# EAGLE design mega (EAGLE 9.2.2)
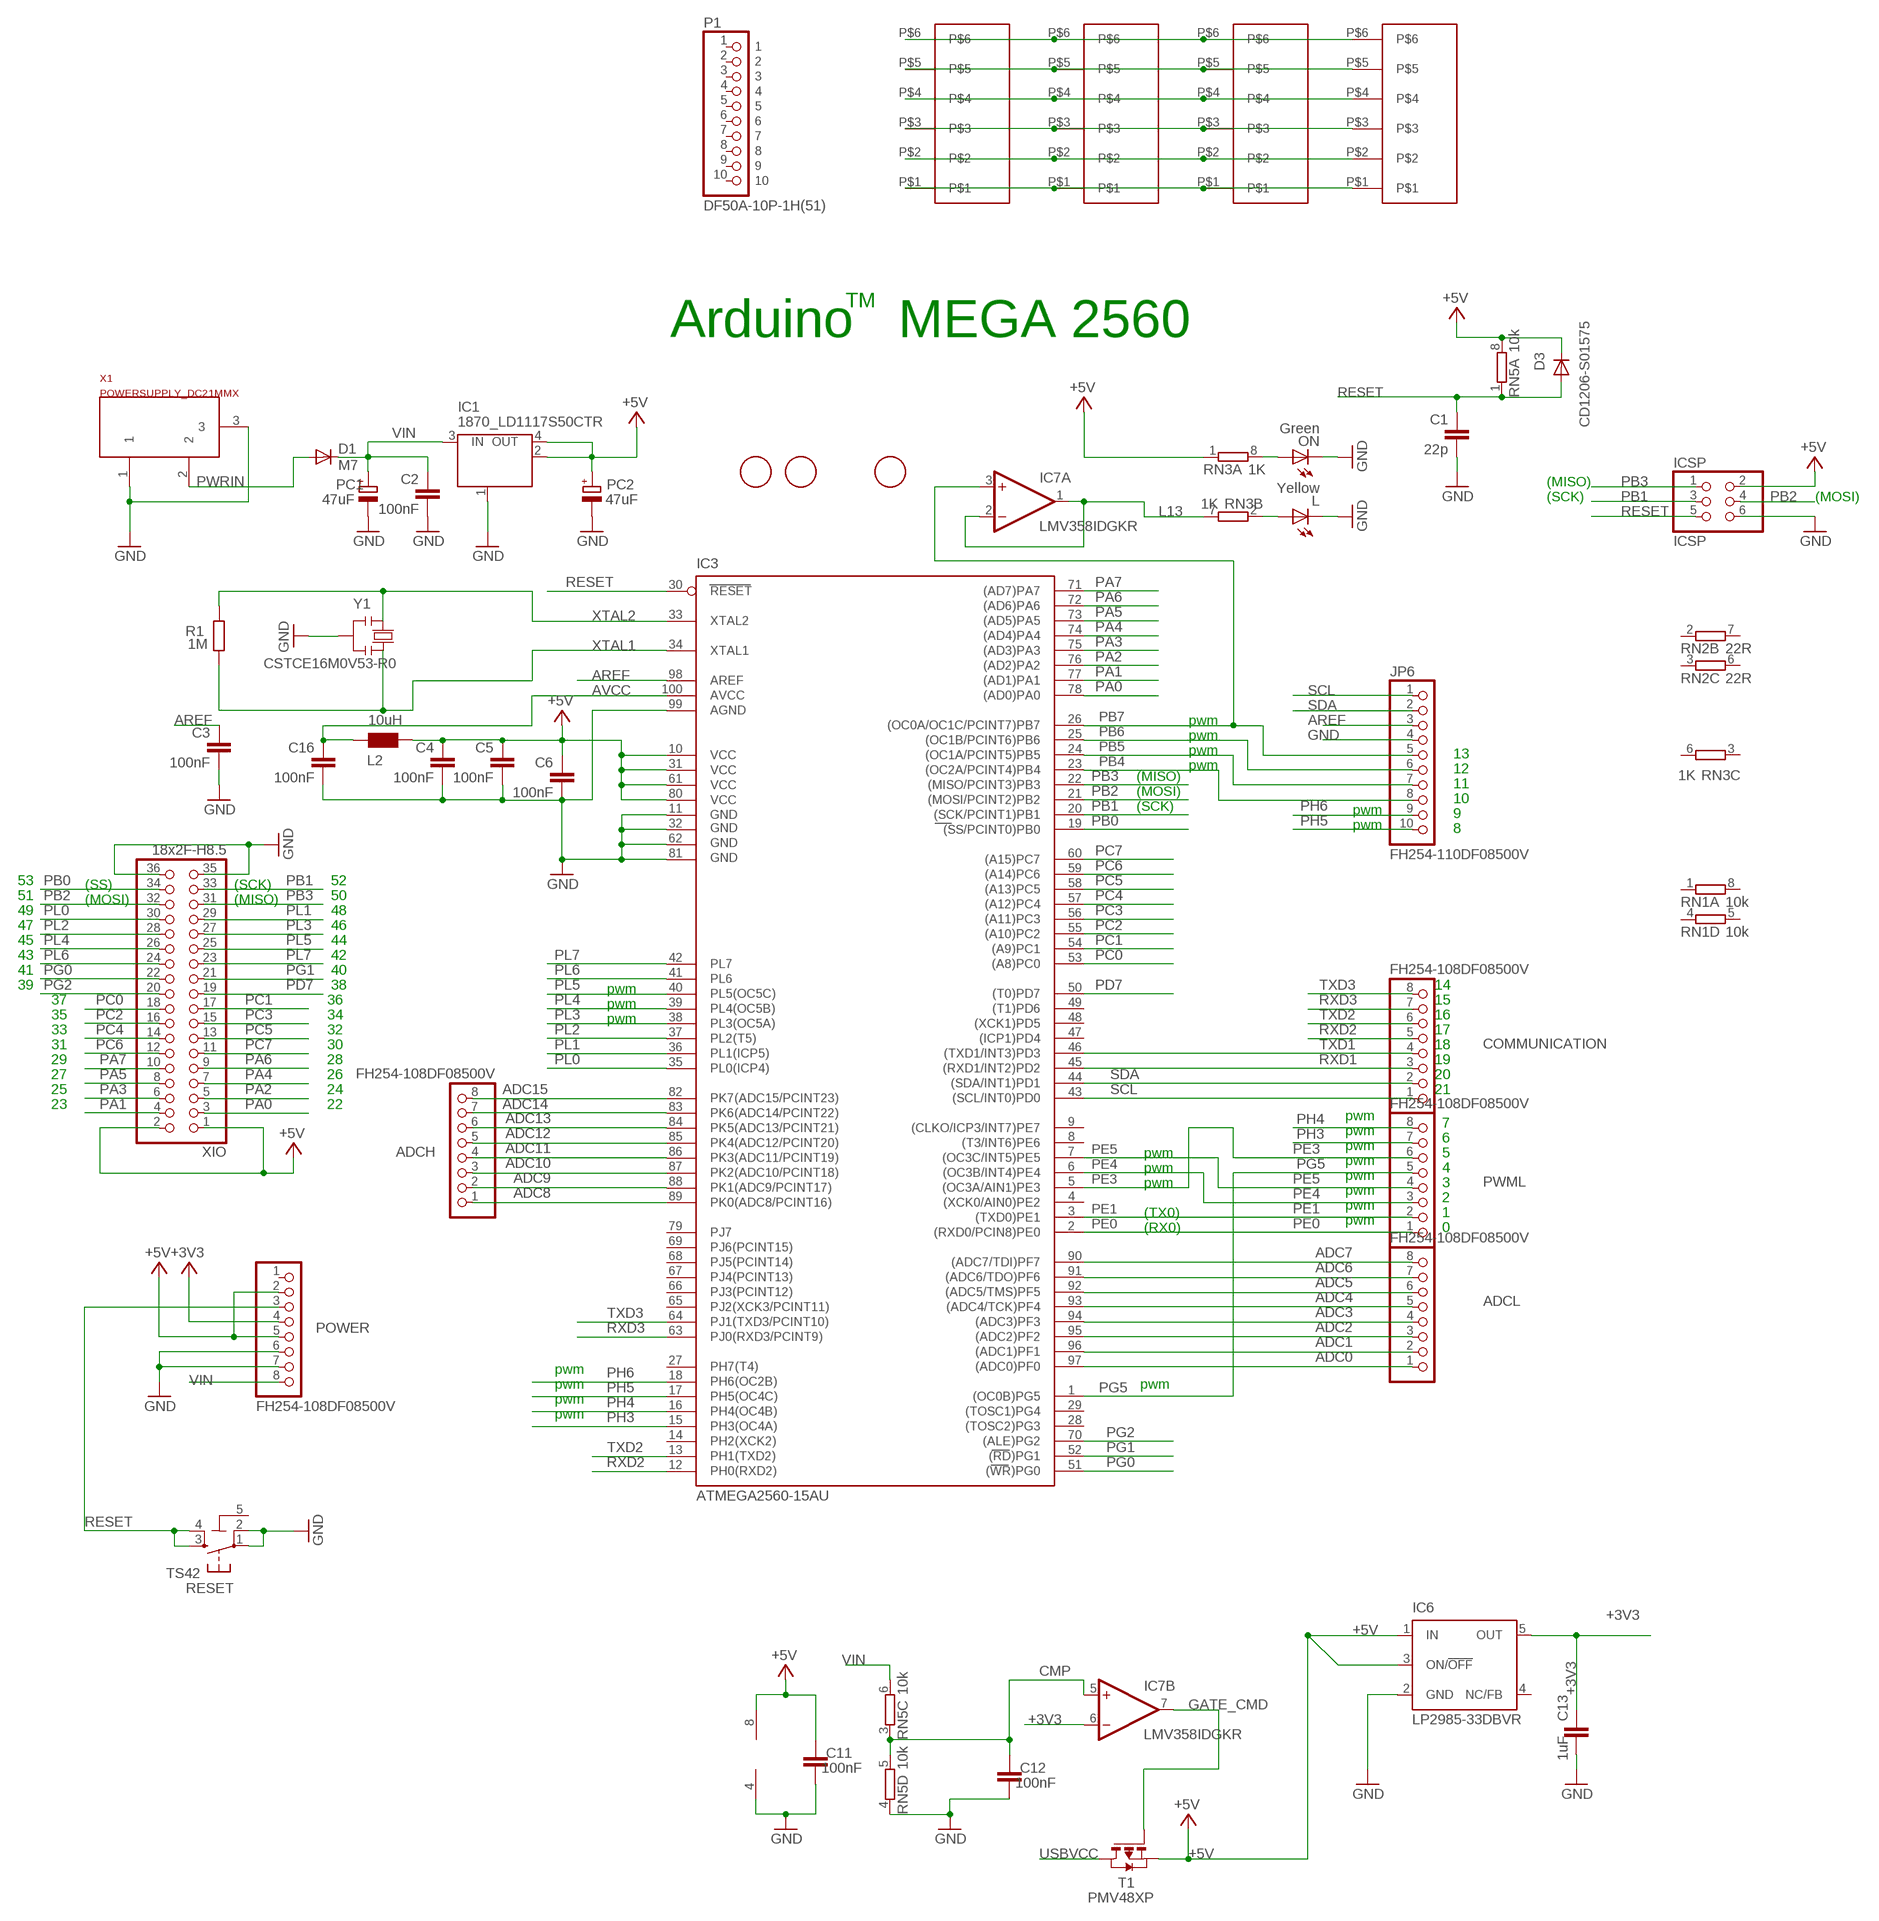
[diagram p0: schematic, sheet 1, part 1 of 2]
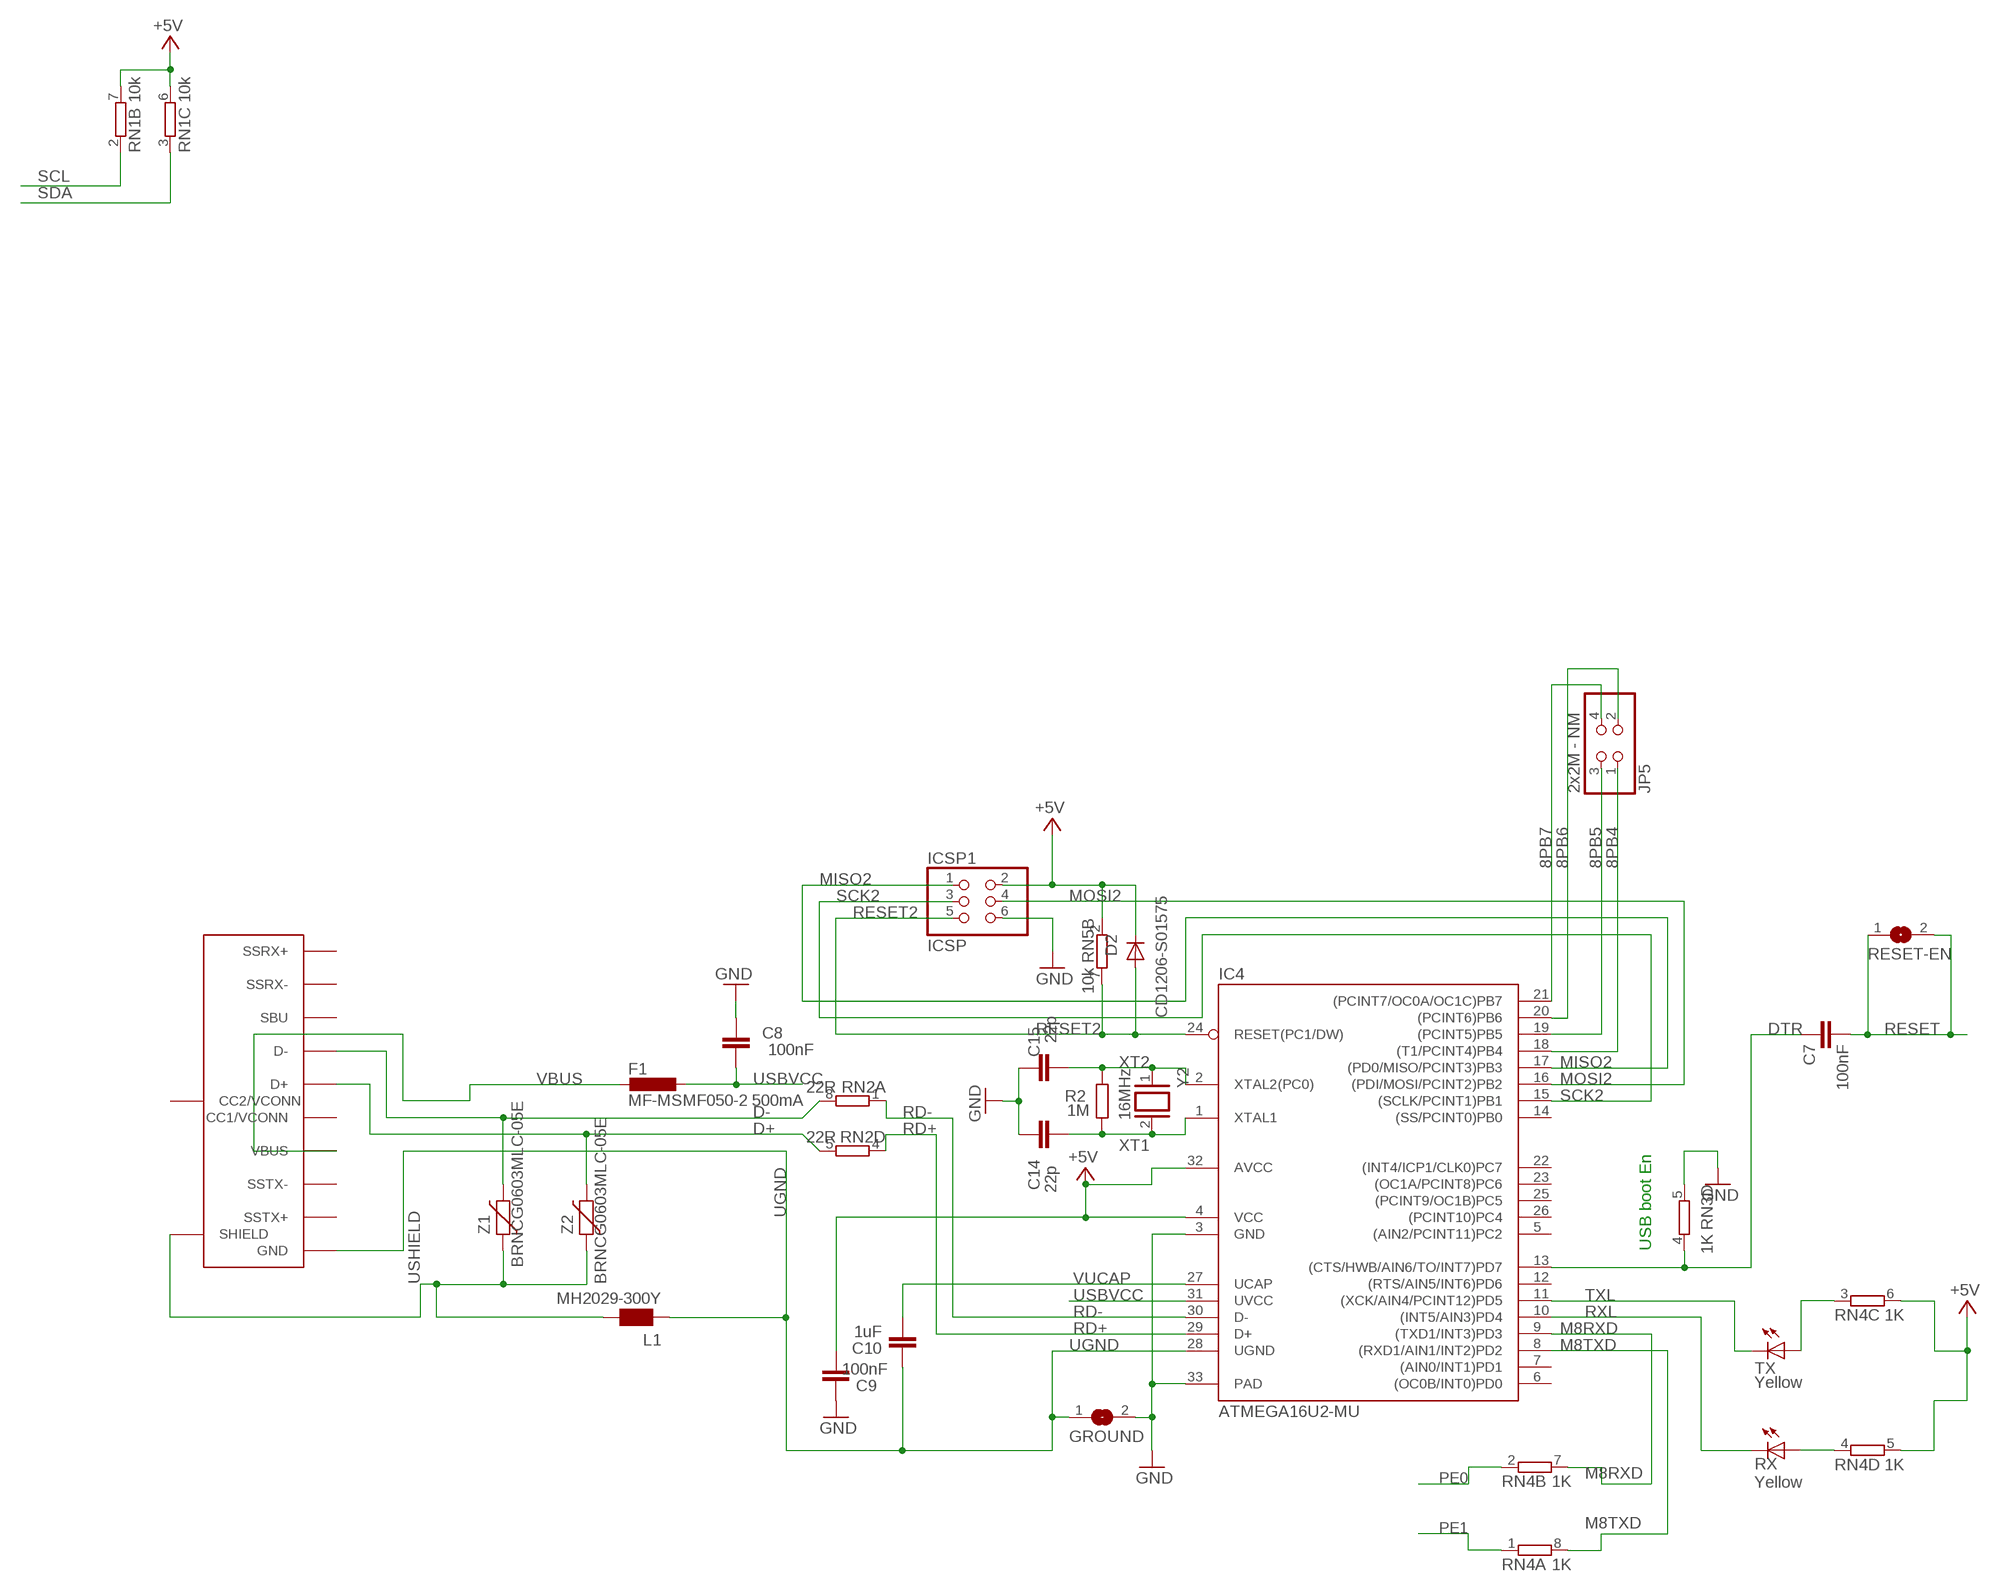
[diagram p1: schematic, sheet 1, part 2 of 2]

## Parts
ADCH  FH254-108DF08500V  0058_FH254-108DF08500V  [1X08]
ADCL  FH254-108DF08500V  0058_FH254-108DF08500V  [1X08]
C1  22p  0014_22PF_0603  [C0603-ROUND]
C2  100nF  0015_100NF_0603  [C0603-ROUND]
C3  100nF  0015_100NF_0603  [C0603-ROUND]
C4  100nF  0015_100NF_0603  [C0603-ROUND]
C5  100nF  0015_100NF_0603  [C0603-ROUND]
C6  100nF  0015_100NF_0603  [C0603-ROUND]
C7  100nF  0015_100NF_0603  [C0603-ROUND]
C8  100nF  0015_100NF_0603  [C0603-ROUND]
C9  100nF  0015_100NF_0603  [C0603-ROUND]
C10  1uF  0006_1UF_0603/GRM188R61E105KA12D  [C0603-ROUND]
C11  100nF  0015_100NF_0603  [C0603-ROUND]
C12  100nF  0015_100NF_0603  [C0603-ROUND]
C13  1uF  0006_1UF_0603/GRM188R61E105KA12D  [C0603-ROUND]
C14  22p  0014_22PF_0603  [C0603-ROUND]
C15  22p  0014_22PF_0603  [C0603-ROUND]
C16  100nF  0015_100NF_0603  [C0603-ROUND]
COMMUNICATION  FH254-108DF08500V  0058_FH254-108DF08500V  [1X08]
D1  M7  0020_M7  [SMB]
D2  CD1206-S01575  0012_CD1206-S01575  [MINIMELF]
D3  CD1206-S01575  0012_CD1206-S01575  [MINIMELF]
F1  MF-MSMF050-2 500mA  0002_MF-MSMF050-2  [L1812]
FD1  FIDUCIALMOUNT  [FIDUCIA-MOUNT]
FD2  FIDUCIALMOUNT  [FIDUCIA-MOUNT]
FD4  FIDUCIALMOUNT  [FIDUCIA-MOUNT]
GROUND  SJ  [SJ]
IC1  1870_LD1117S50CTR  [LINEAR_SOT223]
IC3  ATMEGA2560-15AU  0023_ATMEGA2560-16AU  [TQFP100]
IC4  ATMEGA16U2-MU  0007_ATMEGA16U2-MUR  [MLF32]
IC6  LP2985-33DBVR  0008_TEXLP2985-33DBVR  [SOT23-DBV]
IC7  LMV358IDGKR  0021_LMV358IDGKR  [MSOP08]
ICSP  ICSP  0114_PH254-203DF118A00V  [2X03]
ICSP1  ICSP  0114_PH254-203DF118A00V  [2X03]
JP5  2x2M - NM  PINHD-2X2  [2X02]
JP6  FH254-110DF08500V  1216_FH254-110DF08500T30  [1X10]
L  Yellow  0044_KPT-2012YC  [CHIPLED_0805]
L1  MH2029-300Y  0001_BLM21PG300SN1D_/_MH2029-300Y  [0805]
L2  10uH  0715_CV201210-100K  [0805]
ON  Green  0043_KPT-2012SGC  [CHIPLED_0805]
P1  DF50A-10P-1H(51)  [HRS_DF50A-10P-1H(51)]
PC1  47uF  0113_47UF  [PANASONIC_D]
PC2  47uF  0113_47UF  [PANASONIC_D]
POWER  FH254-108DF08500V  1217_FH254-108DF08500T21  [1X08]
PWML  FH254-108DF08500V  1218_FH254-108DF08500T20  [1X08]
R1  1M  0004_0603_1M  [R0603-ROUND]
R2  1M  0004_0603_1M  [R0603-ROUND]
RESET  TS42  0946_TS42031-160W-TR-7260  [TS42]
RESET-EN  SJ  [SJ]
RN1  10k  0016_064R_10K_/_CAY16-103J4LF  [CAY16]
RN2  22R  0003_064R_22R_/_CAY16-220J4LF  [CAY16]
RN3  1K  0005_064R_1K_/_CAY16-102J4LF  [CAY16]
RN4  1K  0005_064R_1K_/_CAY16-102J4LF  [CAY16]
RN5  10k  0016_064R_10K_/_CAY16-103J4LF  [CAY16]
RX  Yellow  0044_KPT-2012YC  [CHIPLED_0805]
T1  PMV48XP  0297_PMV48XP  [SOT-23]
TX  Yellow  0044_KPT-2012YC  [CHIPLED_0805]
U$1  USB-TYPE-C  [USB-TYPE-C-SMT]
U$2  6PINHERM  [6PINHERMSMD]
U$3  6PINHERM  [6PINHERMSMD]
U$4  6PINHERM  [6PINHERMSMD]
U$5  6PINHERM  [6PINHERMSMD]
X1  POWERSUPPLY_DC21MMX  [POWERSUPPLY_DC-21MM]
XIO  18x2F-H8.5  0060_FH254-218DF08500V  [2X18]
Y1  CSTCE16M0V53-R0  0011_CSTCE16M0V53-R0  [RESONATOR]
Y2  16MHz  0019_P011052006_16M  [QS]
Z1  BRNCG0603MLC-05E  0010_BRNCG0603MLC-05E  [CT/CN0603]
Z2  BRNCG0603MLC-05E  0010_BRNCG0603MLC-05E  [CT/CN0603]

## Nets
8PB4: IC4.18((T1/PCINT4)PB4) JP5.1
8PB5: IC4.19((PCINT5)PB5) JP5.3
8PB6: IC4.20((PCINT6)PB6) JP5.2
8PB7: IC4.21((PCINT7/OC0A/OC1C)PB7) JP5.4
+3V3 [power]: C13.2 IC6.5(OUT) IC7.6(B:-IN) POWER.4
+5V [power usb]: C4.1 C5.1 C6.1 C9.1 C11.2 D2.C D3.C IC1.2(OUT) IC1.4(OUT) IC3.10(VCC) IC3.31(VCC1) IC3.61(VCC2) IC3.80(VCC3) IC4.4(VCC) IC4.32(AVCC) IC6.1(IN) IC6.3(ON/!OFF) IC7.8(P:V+) ICSP1.2 ICSP.2 L2.2 PC2.+ POWER.2 POWER.5 RN1.6 RN1.7 RN3.1 RN4.5 RN4.6 RN5.2 RN5.8 T1.2(S) XIO.1 XIO.2
ADC0: ADCL.1 IC3.97((ADC0)PF0)
ADC1: ADCL.2 IC3.96((ADC1)PF1)
ADC2: ADCL.3 IC3.95((ADC2)PF2)
ADC3: ADCL.4 IC3.94((ADC3)PF3)
ADC4: ADCL.5 IC3.93((ADC4/TCK)PF4)
ADC5: ADCL.6 IC3.92((ADC5/TMS)PF5)
ADC6: ADCL.7 IC3.91((ADC6/TDO)PF6)
ADC7: ADCL.8 IC3.90((ADC7/TDI)PF7)
ADC8: ADCH.1 IC3.89(PK0(ADC8/PCINT16))
ADC9: ADCH.2 IC3.88(PK1(ADC9/PCINT17))
ADC10: ADCH.3 IC3.87(PK2(ADC10/PCINT18))
ADC11: ADCH.4 IC3.86(PK3(ADC11/PCINT19))
ADC12: ADCH.5 IC3.85(PK4(ADC12/PCINT20))
ADC13: ADCH.6 IC3.84(PK5(ADC13/PCINT21))
ADC14: ADCH.7 IC3.83(PK6(ADC14/PCINT22))
ADC15: ADCH.8 IC3.82(PK7(ADC15/PCINT23))
AREF: C3.1 IC3.98(AREF) JP6.3
AVCC [power usb]: C16.1 IC3.100(AVCC) L2.1
CMP: C12.2 IC7.5(B:+IN) RN5.3 RN5.5
D+: RN2.5 U$1.6(D+) U$1.B6(D+) Z2.2
D-: RN2.8 U$1.7(D-) U$1.B7(D-) Z1.2
DTR: C7.1 IC4.13((CTS/HWB/AIN6/TO/INT7)PD7) RN3.4
GATE_CMD: IC7.7(B:OUT) T1.3(G)
GND [gnd]: C1.2 C2.2 C3.2 C4.2 C5.2 C6.2 C8.2 C9.2 C11.1 C12.1 C13.1 C14.2 C15.2 C16.2 GROUND.2 IC1.1(GND/ADJ) IC3.11(GND) IC3.32(GND1) IC3.62(GND2) IC3.81(GND3) IC3.99(AGND) IC4.3(GND) IC4.33(PAD) IC6.2(GND) IC7.4(P:V-) ICSP1.6 ICSP.6 JP6.4 L.C ON.C PC1.- PC2.- POWER.6 POWER.7 RESET.1 RESET.2 RN3.5 RN5.4 X1.1 X1.3 XIO.35 XIO.36 Y1.2
L13: IC7.1(A:OUT) IC7.2(A:-IN) RN3.7
M8RXD: IC4.9((TXD1/INT3)PD3) RN4.7
M8TXD: IC4.8((RXD1/AIN1/INT2)PD2) RN4.8
MISO2: IC4.17((PD0/MISO/PCINT3)PB3) ICSP1.1
MOSI2: IC4.16((PDI/MOSI/PCINT2)PB2) ICSP1.4
N$1: U$2.P$6 U$3.P$6 U$4.P$6 U$5.P$6
N$2: L.A RN3.2
N$3: ON.A RN3.8
N$4: U$2.P$5 U$3.P$5 U$4.P$5 U$5.P$5
N$5: U$2.P$4 U$3.P$4 U$4.P$4 U$5.P$4
N$6: U$2.P$3 U$3.P$3 U$4.P$3 U$5.P$3
N$7: U$2.P$2 U$3.P$2 U$4.P$2 U$5.P$2
N$8: U$2.P$1 U$3.P$1 U$4.P$1 U$5.P$1
N$54: RN4.4 RX.A
N$55: RN4.3 TX.A
PA0: IC3.78((AD0)PA0) XIO.3
PA1: IC3.77((AD1)PA1) XIO.4
PA2: IC3.76((AD2)PA2) XIO.5
PA3: IC3.75((AD3)PA3) XIO.6
PA4: IC3.74((AD4)PA4) XIO.7
PA5: IC3.73((AD5)PA5) XIO.8
PA6: IC3.72((AD6)PA6) XIO.9
PA7: IC3.71((AD7)PA7) XIO.10
PB0: IC3.19((SS/PCINT0)PB0) XIO.34
PB1: IC3.20((SCK/PCINT1)PB1) ICSP.3 XIO.33
PB2: IC3.21((MOSI/PCINT2)PB2) ICSP.4 XIO.32
PB3: IC3.22((MISO/PCINT3)PB3) ICSP.1 XIO.31
PB4: IC3.23((OC2A/PCINT4)PB4) JP6.8
PB5: IC3.24((OC1A/PCINT5)PB5) JP6.7
PB6: IC3.25((OC1B/PCINT6)PB6) JP6.6
PB7: IC3.26((OC0A/OC1C/PCINT7)PB7) IC7.3(A:+IN) JP6.5
PC0: IC3.53((A8)PC0) XIO.18
PC1: IC3.54((A9)PC1) XIO.17
PC2: IC3.55((A10)PC2) XIO.16
PC3: IC3.56((A11)PC3) XIO.15
PC4: IC3.57((A12)PC4) XIO.14
PC5: IC3.58((A13)PC5) XIO.13
PC6: IC3.59((A14)PC6) XIO.12
PC7: IC3.60((A15)PC7) XIO.11
PD7: IC3.50((T0)PD7) XIO.19
PE0: IC3.2((RXD0/PCIN8)PE0) PWML.1 RN4.2
PE1: IC3.3((TXD0)PE1) PWML.2 RN4.1
PE3: IC3.5((OC3A/AIN1)PE3) PWML.6
PE4: IC3.6((OC3B/INT4)PE4) PWML.3
PE5: IC3.7((OC3C/INT5)PE5) PWML.4
PG0: IC3.51((WR)PG0) XIO.22
PG1: IC3.52((RD)PG1) XIO.21
PG2: IC3.70((ALE)PG2) XIO.20
PG5: IC3.1((OC0B)PG5) PWML.5
PH3: IC3.15(PH3(OC4A)) PWML.7
PH4: IC3.16(PH4(OC4B)) PWML.8
PH5: IC3.17(PH5(OC4C)) JP6.10
PH6: IC3.18(PH6(OC2B)) JP6.9
PL0: IC3.35(PL0(ICP4)) XIO.30
PL1: IC3.36(PL1(ICP5)) XIO.29
PL2: IC3.37(PL2(T5)) XIO.28
PL3: IC3.38(PL3(OC5A)) XIO.27
PL4: IC3.39(PL4(OC5B)) XIO.26
PL5: IC3.40(PL5(OC5C)) XIO.25
PL6: IC3.41(PL6) XIO.24
PL7: IC3.42(PL7) XIO.23
PWRIN [power]: D1.A X1.2
RD+: IC4.29(D+) RN2.4
RD-: IC4.30(D-) RN2.1
RESET: C1.1 C7.2 D3.A IC3.30(RESET) ICSP.5 POWER.3 RESET-EN.1 RESET-EN.2 RESET.3 RESET.4 RN5.1
RESET2: D2.A IC4.24(RESET(PC1/DW)) ICSP1.5 RN5.7
RXD1: COMMUNICATION.3 IC3.45((RXD1/INT2)PD2)
RXD2: COMMUNICATION.5 IC3.12(PH0(RXD2))
RXD3: COMMUNICATION.7 IC3.63(PJ0(RXD3/PCINT9))
RXL: IC4.10((INT5/AIN3)PD4) RX.C
SCK2: IC4.15((SCLK/PCINT1)PB1) ICSP1.3
SCL: COMMUNICATION.1 IC3.43((SCL/INT0)PD0) JP6.1 RN1.2
SDA: COMMUNICATION.2 IC3.44((SDA/INT1)PD1) JP6.2 RN1.3
TXD1: COMMUNICATION.4 IC3.46((TXD1/INT3)PD3)
TXD2: COMMUNICATION.6 IC3.13(PH1(TXD2))
TXD3: COMMUNICATION.8 IC3.64(PJ1(TXD3/PCINT10))
TXL: IC4.11((XCK/AIN4/PCINT12)PD5) TX.C
UGND [gnd]: C10.2 GROUND.1 IC4.28(UGND) L1.1 U$1.1(GND) U$1.12(GND) U$1.B1(GND) U$1.B12(GND)
USBVCC [power usb]: C8.1 F1.1 IC4.31(UVCC) T1.1(D)
USHIELD [gnd]: L1.2 U$1.P$1(SHIELD) U$1.P$2(SHIELD) U$1.P$3(SHIELD) U$1.P$4(SHIELD) U$1.P$5(SHIELD) U$1.P$6(SHIELD) U$1.P$7(SHIELD) U$1.P$8(SHIELD) U$1.P$9(SHIELD) U$1.P$10(SHIELD) U$1.P$11(SHIELD) U$1.P$12(SHIELD) U$1.P$13(SHIELD) U$1.P$14(SHIELD) U$1.P$15(SHIELD) U$1.P$16(SHIELD) U$1.P$17(SHIELD) U$1.P$18(SHIELD) U$1.P$19(SHIELD) U$1.P$20(SHIELD) U$1.P$21(SHIELD) U$1.P$22(SHIELD) U$1.P$23(SHIELD) U$1.P$24(SHIELD) U$1.P$25(SHIELD) U$1.P$26(SHIELD) U$1.P$27(SHIELD) U$1.P$28(SHIELD) Z1.1 Z2.1
VBUS [power usb]: F1.2 U$1.4(VBUS) U$1.9(VBUS) U$1.B4(VBUS) U$1.B9(VBUS)
VIN [power]: C2.1 D1.C IC1.3(IN) PC1.+ POWER.8 RN5.6
VUCAP: C10.1 IC4.27(UCAP)
XT1: C14.1 IC4.1(XTAL1) R2.1 Y2.2
XT2: C15.1 IC4.2(XTAL2(PC0)) R2.2 Y2.1
XTAL1: IC3.34(XTAL1) R1.1 Y1.3
XTAL2: IC3.33(XTAL2) R1.2 Y1.1
Unconnected: IC3.4((XCK0/AIN0)PE2) IC3.8((T3/INT6)PE6) IC3.9((CLKO/ICP3/INT7)PE7) IC3.14(PH2(XCK2)) IC3.27(PH7(T4)) IC3.28((TOSC2)PG3) IC3.29((TOSC1)PG4) IC3.47((ICP1)PD4) IC3.48((XCK1)PD5) IC3.49((T1)PD6) IC3.65(PJ2(XCK3/PCINT11)) IC3.66(PJ3(PCINT12)) IC3.67(PJ4(PCINT13)) IC3.68(PJ5(PCINT14)) IC3.69(PJ6(PCINT15)) IC3.79(PJ7) IC4.5((AIN2/PCINT11)PC2) IC4.6((OC0B/INT0)PD0) IC4.7((AIN0/INT1)PD1) IC4.12((RTS/AIN5/INT6)PD6) IC4.14((SS/PCINT0)PB0) IC4.22((INT4/ICP1/CLK0)PC7) IC4.23((OC1A/PCINT8)PC6) IC4.25((PCINT9/OC1B)PC5) IC4.26((PCINT10)PC4) IC6.4(NC/FB) P1.1 P1.2 P1.3 P1.4 P1.5 P1.6 P1.7 P1.8 P1.9 P1.10 POWER.1 RN1.1 RN1.4 RN1.5 RN1.8 RN2.2 RN2.3 RN2.6 RN2.7 RN3.3 RN3.6 U$1.2(SSTX+) U$1.3(SSTX-) U$1.5(CC1/VCONN) U$1.8(SBU) U$1.10(SSRX-) U$1.11(SSRX+) U$1.B2(SSTX+) U$1.B3(SSTX-) U$1.B5(CC2/VCONN) U$1.B8(SBU) U$1.B10(SSRX-) U$1.B11(SSRX+)

## Notes on the sheet
- TM
- Arduino   MEGA 2560
- (MISO)
- (SCK) | (MOSI)
- pwm
- pwm
- pwm | 13
- pwm | 12
- (MISO)
- 11
- (MOSI)
- 10
- (SCK) | pwm
- 9
- pwm | 8
- 53 | (SS) | (SCK) | 52
- 51 | (MOSI) | (MISO) | 50
- 49 | 48
- 47 | 46
- 45 | 44
- 43 | 42
- 41 | 40
- 39 | 38 | pwm | 14
- 37 | 36 | pwm | 15
- 35 | 34 | pwm | 16
- 33 | 32 | 17
- 31 | 30 | 18
- 29 | 28 | 19
- 27 | 26 | 20
- 25 | 24 | 21
- 23 | 22
- pwm
- 7
- pwm
- 6
- pwm
- pwm | 5
- pwm
- pwm | 4
- pwm
- pwm | 3
- pwm
- 2
- pwm
- (TX0) | 1
- pwm
- (RX0) | 0
- pwm
- pwm | pwm
- pwm
- pwm
- USB boot En

## Power pins joined to a net without a drawn wire
5-GND: RESET.5(5-GND)

## Library data of the parts
ADCH ADCL COMMUNICATION = Connettori:0058_FH254-108DF08500V: Female Connector strip for Arduino bases - 8x1 F V h 8,5 p2,54mm; MONTHLY_USAGE: _____; PART_NUMBER: FH254-108DF08500V; PRICE: _____; SUPPLIER: _____; TYPE: Connettori
C1 C14 C15 = Condensatori:0014_22PF_0603: 22pF 0603; CASE: 0603; MONTHLY_USAGE: _____; PART_NUMBER: 22pF_0603; PRICE: _____; SUPPLIER: _____; TYPE: Condensatori
C2-C9 C11 C12 C16 = Condensatori:0015_100NF_0603: 100nF 0603 50V; CASE: 0603; MONTHLY_USAGE: _____; PART_NUMBER: cl10b104kbnc; PRICE: _____; SUPPLIER: _____; TYPE: Condensatori
C10 C13 = Condensatori:0006_1UF_0603/GRM188R61E105KA12D: 1uF 0603; CASE: 0603; MONTHLY_USAGE: _____; PART_NUMBER: 1uF_0603/GRM188R61E105KA12D; PRICE: _____; SUPPLIER: _____; TYPE: Condensatori
D1 = Diodi:0020_M7: 1.0A 40V SURFACE MOUNT GLASS PASSIVATED RECTIFIER M7; CASE: SMA; MONTHLY_USAGE: _____; PART_NUMBER: M7; PRICE: _____; SUPPLIER: _____; TYPE: Diodi
D2 D3 = Diodi:0012_CD1206-S01575: small-signal high-speed Switching Diodes CD1206; CASE: 1206; MONTHLY_USAGE: _____; PART_NUMBER: CD1206-S01575; PRICE: _____; SUPPLIER: _____; TYPE: Diodi
F1 = Protezione:0002_MF-MSMF050-2: 500 mA Multifuse � Polyfuse; MONTHLY_USAGE: _____; PART_NUMBER: MF-MSMF050-2; PRICE: _____; SUPPLIER: _____; TYPE: Protezione
FD1 FD2 FD4 = SmartPrj:FIDUCIALMOUNT
GROUND RESET-EN = jumper:SJ: SMD solder JUMPER
IC1 = IntegratedCircuits:1870_LD1117S50CTR: Low-dropout linear regulator 5V -LM1117IMPX-5.0; CASE: SOT223; MONTHLY_USAGE: _____; PART_NUMBER: LD1117S50CTR; PRICE: _____; SUPPLIER: _____; TYPE: Circuito_Integrato; VALUE: LD1117S50CTR
IC3 = IntegratedCircuits:0023_ATMEGA2560-16AU: 8-bit Microcontroller with 256K Bytes In-System Programmable Flash - ATMEGA2560-16AU; CASE: TQFP100_14x14; MONTHLY_USAGE: _____; PART_NUMBER: ATMEGA2560-16AU; PRICE: _____; SUPPLIER: _____; TYPE: Circuito_Integrato
IC4 = IntegratedCircuits:0007_ATMEGA16U2-MUR: 8-bit Microcontroller with 16K Bytes of ISP Flash and USB Controller ATMEGA16U2-MUR; CASE: QFN32_5x5; MONTHLY_USAGE: _____; PART_NUMBER: ATMEGA16U2-MUR; PRICE: _____; SUPPLIER: _____; TYPE: Circuito_Integrato
IC6 = IntegratedCircuits:0008_TEXLP2985-33DBVR: 150-mA LOW-NOISE LOW-DROPOUT REGULATOR WITH SHUTDOWN LP2985-33DBVR; CASE: SOT23-5; MONTHLY_USAGE: _____; PART_NUMBER: TEXLP2985-33DBVR; PRICE: _____; SUPPLIER: _____; TYPE: Circuito_Integrato
IC7 = IntegratedCircuits:0021_LMV358IDGKR: Dual low-voltage (2.7 V to 5.5 V), operational amplifiers with rail-to-rail output swing LMV358IDGKR; CASE: MSOP8; MONTHLY_USAGE: _____; PART_NUMBER: LMV358IDGKR; PRICE: _____; SUPPLIER: _____; TYPE: Circuito_Integrato
ICSP ICSP1 = Connettori:0114_PH254-203DF118A00V: 3x2 M V h 8,5 mm p2,54; MONTHLY_USAGE: _____; PART_NUMBER: PH254-203DF118A00V; PRICE: _____; SUPPLIER: _____; TYPE: Connettori
JP5 = SmartPrj:PINHD-2X2: PIN HEADER
JP6 = Connettori:1216_FH254-110DF08500T30: Female Connector strip for Arduino bases - 10x1 F V h 8,5 p2,54 serigrafato STRISCIA VUOTA; MONTHLY_USAGE: _____; PART_NUMBER: FH254-110DF08500T30; PRICE: _____; SUPPLIER: _____; TYPE: Connettori; VALUE: FH254-110DF08500T30
L RX TX = Opto:0044_KPT-2012YC: LED YELLOW - SMD - 0805; MONTHLY_USAGE: _____; PART_NUMBER: KPT-2012YC; PRICE: _____; SUPPLIER: _____; TYPE: Opto
L1 = Protezione:0001_BLM21PG300SN1D_/_MH2029-300Y: BLM21; MONTHLY_USAGE: _____; PART_NUMBER: BLM21PG300SN1D_/_MH2029-300Y; PRICE: _____; SUPPLIER: _____; TYPE: Protezione
L2 = Induttanze:0715_CV201210-100K: 10uH 0805; CASE: 0805; MONTHLY_USAGE: _____; PART_NUMBER: CV201210-100K; PRICE: _____; SUPPLIER: _____; TYPE: Induttanze
ON = Opto:0043_KPT-2012SGC: LED GREEN - SMD-0805; MONTHLY_USAGE: _____; PART_NUMBER: KPT-2012SGC; PRICE: _____; SUPPLIER: _____; TYPE: Opto
P1 = DF50A-10P-1H_51_:DF50A-10P-1H(51): Conn Shrouded Header HDR 10 POS 1mm Solder RA SMD T/R; AVAILABILITY: Unavailable; DESCRIPTION: Conn Shrouded Header HDR 10 POS 1mm Solder RA SMD T/R; MF: Hirose; MP: DF50A-10P-1H_51_; PACKAGE: None; PRICE: None
PC1 PC2 = Condensatori:0113_47UF: 47uF; MONTHLY_USAGE: _____; PART_NUMBER: 47uF; PRICE: _____; SUPPLIER: _____; TYPE: Condensatori
POWER = Connettori:1217_FH254-108DF08500T21: Female Connector strip for Arduino bases - 8x1 F V h 8,5 p2,54 serigrafato POWER; MONTHLY_USAGE: _____; PART_NUMBER: FH254-108DF08500T21; PRICE: _____; SUPPLIER: _____; TYPE: Connettori; VALUE: FH254-108DF08500T21
PWML = Connettori:1218_FH254-108DF08500T20: Female Connector strip for Arduino bases - 8x1 F V h 8,5 p2,54 serigrafato DIGITAL; MONTHLY_USAGE: _____; PART_NUMBER: FH254-108DF08500T20; PRICE: _____; SUPPLIER: _____; TYPE: Connettori; VALUE: FH254-108DF08500T20
R1 R2 = Resistenze:0004_0603_1M: 1M 0603; CASE: 0603; MONTHLY_USAGE: _____; PART_NUMBER: 0603_1M; PRICE: _____; SUPPLIER: _____; TYPE: Resistenze
RESET = Switches:0946_TS42031-160W-TR-7260: Pushbutton 6x6 Smd - White; MONTHLY_USAGE: _____; PART_NUMBER: IT-1157AHNP-160G-G_GTR; PRICE: _____; SUPPLIER: _____; TYPE: Switches
RN1 RN5 = Resistenze:0016_064R_10K_/_CAY16-103J4LF: 10K 064 R; CASE: SMD_3,2x1,6; MONTHLY_USAGE: _____; PART_NUMBER: 064R_10K_/_CAY16-103J4LF; PRICE: _____; SUPPLIER: _____; TYPE: Resistenze
RN2 = Resistenze:0003_064R_22R_/_CAY16-220J4LF: 22R 064R; CASE: SMD_3,2x1,6; MONTHLY_USAGE: _____; PART_NUMBER: 064R_22R_/_CAY16-220J4LF; PRICE: _____; SUPPLIER: _____; TYPE: Resistenze
RN3 RN4 = Resistenze:0005_064R_1K_/_CAY16-102J4LF: 1K 064R; CASE: SMD_3,2x1,6; MONTHLY_USAGE: _____; PART_NUMBER: 064R_1K_/_CAY16-102J4LF; PRICE: _____; SUPPLIER: _____; TYPE: Resistenze
T1 = Transistors:0297_PMV48XP: 20 V, 3.5 A P-channel Trench MOSFET - PMV48XP; CASE: SOT23; MONTHLY_USAGE: _____; PART_NUMBER: PMV48XP; PRICE: _____; SUPPLIER: _____; TYPE: Transistor
U$1 = lio:USB-TYPE-C
U$2-U$5 = te_conectivity_6_pin_herm:6PINHERM: https://www.mouser.com/ProductDetail/TE-Connectivity/2213611-3?qs=sGAEpiMZZMsg%252bek5lc7F5uB08Utn55q4E3YUmFQRoIY%3d
X1 = SmartPrj:POWERSUPPLY_DC21MM
XIO = Connettori:0060_FH254-218DF08500V: 18x2 F V h 8,5 p2,54; MONTHLY_USAGE: _____; PART_NUMBER: FH254-218DF08500V; PRICE: _____; SUPPLIER: _____; TYPE: Connettori
Y1 = Cristalli:0011_CSTCE16M0V53-R0: 16Mhz - SMD; MONTHLY_USAGE: _____; PART_NUMBER: CSTCE16M0V53-R0; PRICE: _____; SUPPLIER: _____; TYPE: Cristalli
Y2 = Cristalli:0019_P011052006_16M: 16MHz THT; PART_NUMBER: P011052006 16M/FTX16M20S; TYPE: Cristalli
Z1 Z2 = Protezione:0010_BRNCG0603MLC-05E: CG0603MLC-05E; MONTHLY_USAGE: _____; PART_NUMBER: BRNCG0603MLC-05E; PRICE: _____; SUPPLIER: _____; TYPE: Protezione

## Net classes
0 default: width 0.203 mm, drill 0.406 mm, clearance 0.203 mm
1 power: width 0.61 mm, drill 0.406 mm, clearance 0.203 mm
2 gnd: width 0.305 mm, drill 0.406 mm, clearance 0.203 mm
3 power usb: width 0.508 mm, drill 0.406 mm, clearance 0.203 mm

## Board
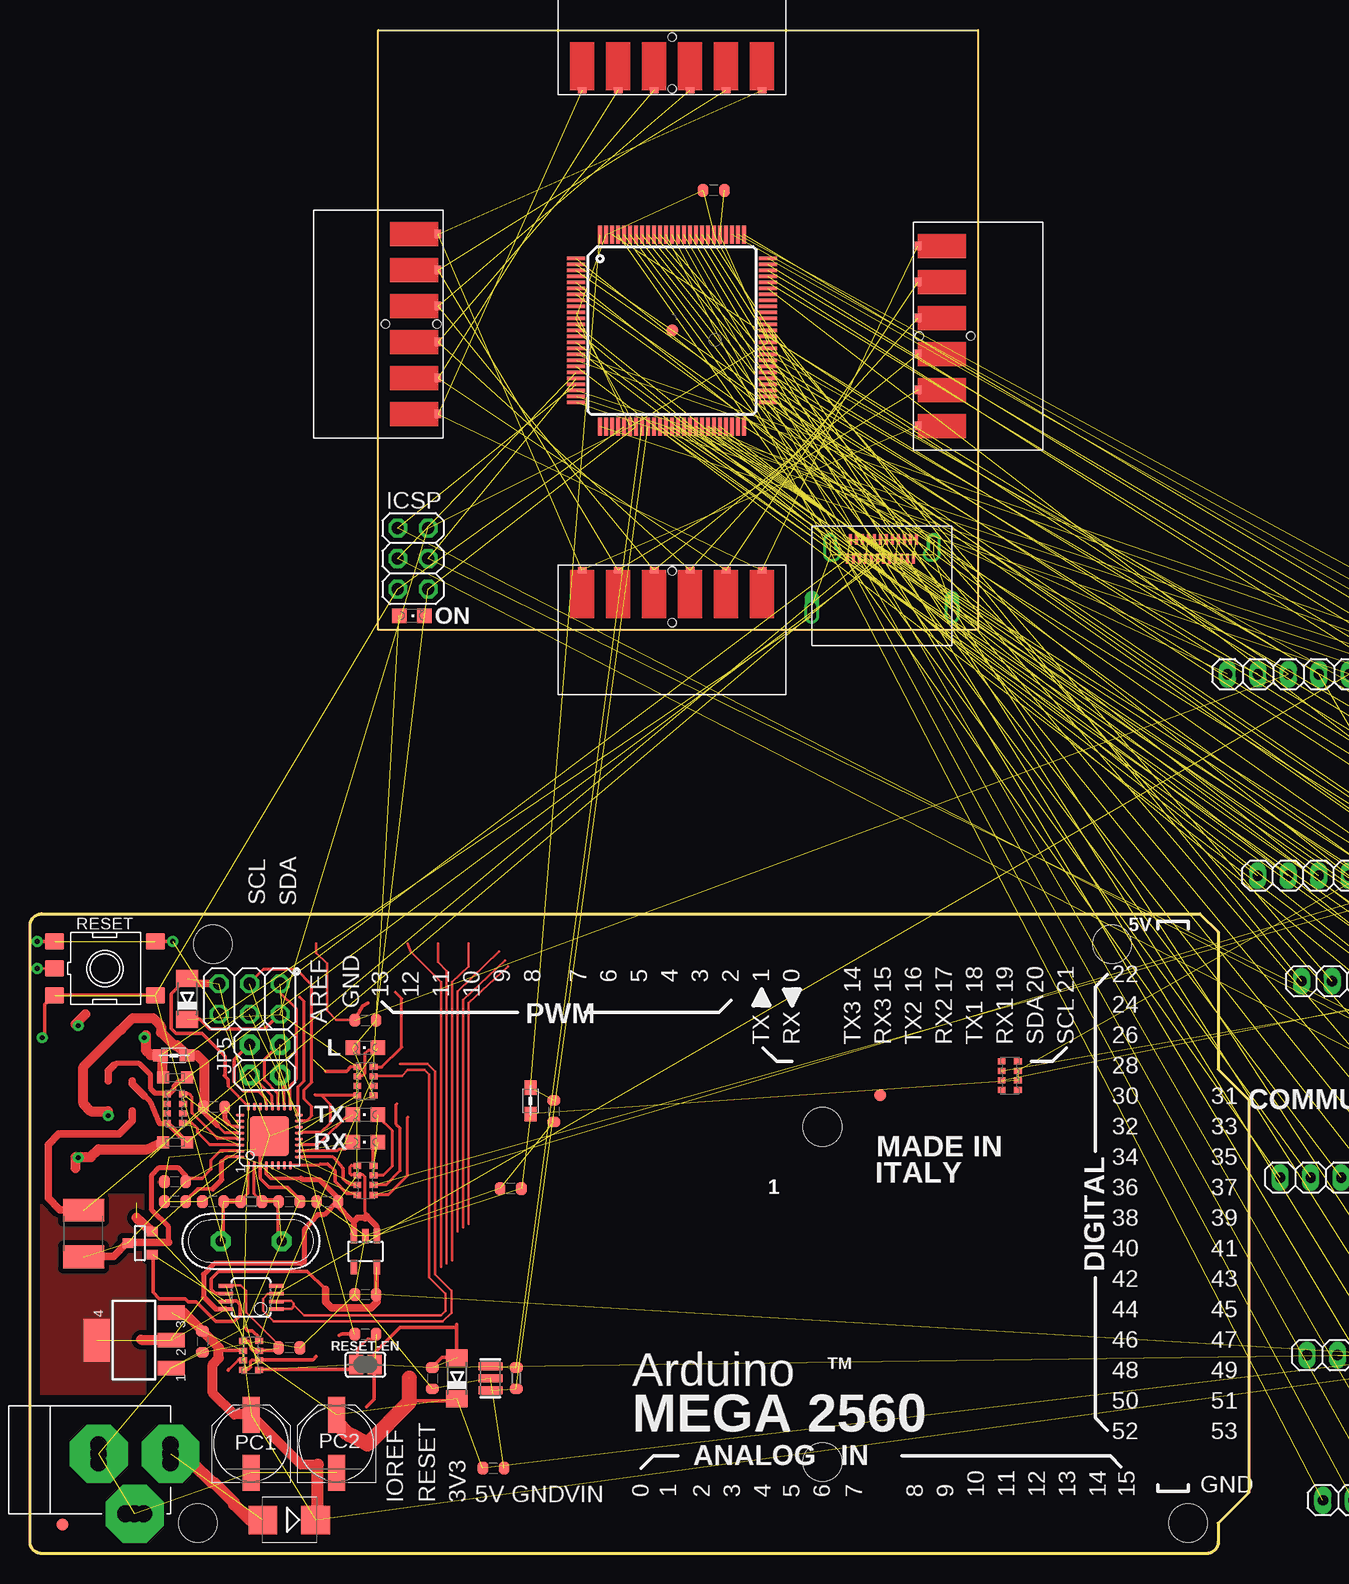
[diagram p2: board, top side]
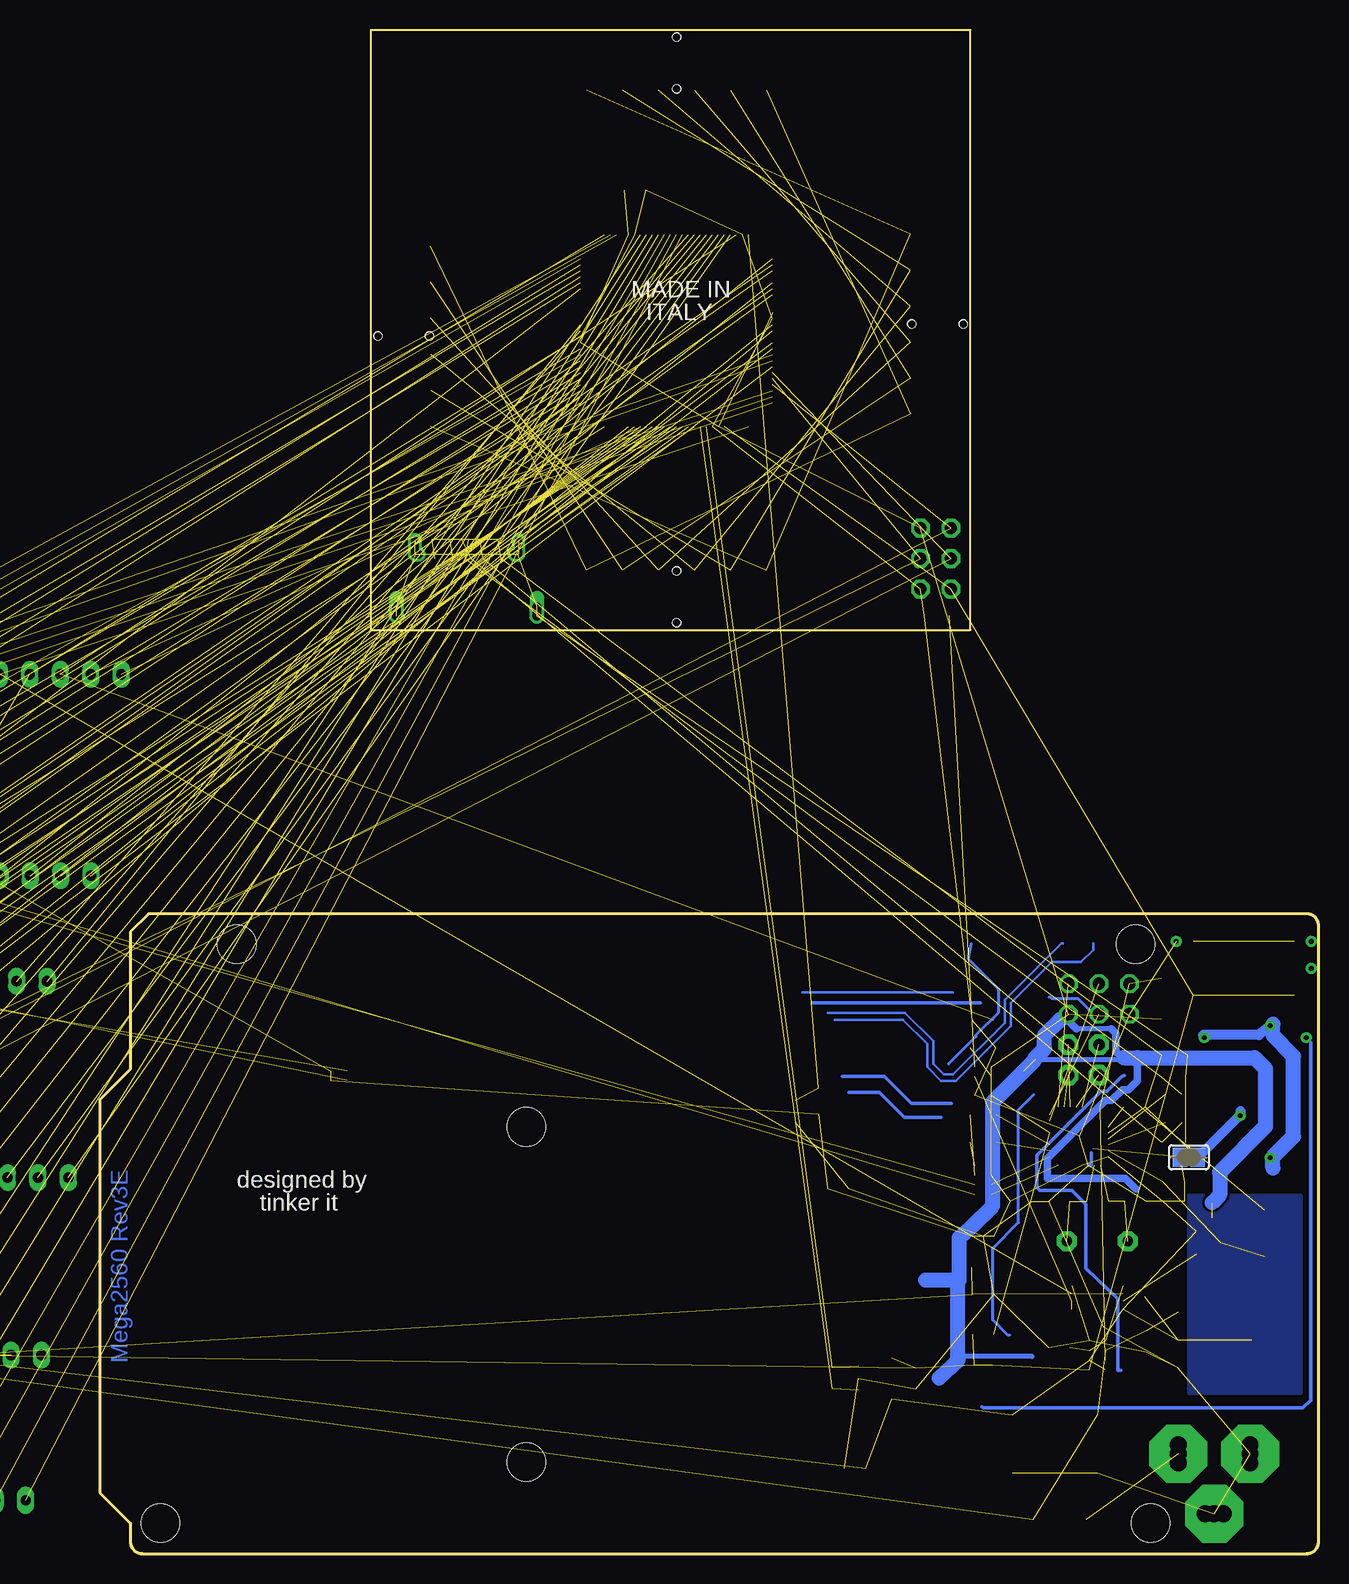
[diagram p3: board, bottom side, seen from below]

Size 101.6 x 127.01 mm. Coordinates in mm from the lower left corner, seen from the top.
Outline: 97.54,53.34 99.06,51.82 99.06,40.39 101.6,37.85 101.6,5.08 99.06,2.54 99.06,1 arc-90 98.06,0 1,0 arc-90 0,1 0,52.34 arc-90 1,53.34 97.54,53.34
Outline: 29.03,127.01 79.03,127.01 79.03,77.01 29.03,77.01 29.03,127.01
Copper layers (1*16): Top 0.035mm / dielectric 1.5mm / Bottom 0.035mm
Design rules "ArduinoMega *": minimum track width 8mil, minimum drill 16mil, track to track 7mil, track to pad 7mil, pad to pad 8mil, via to via 10mil, smd to smd 7mil, copper to edge 27mil, drill to drill 12mil, minimum pad ring 10mil, minimum via ring 10mil, stop-mask expansion 2mil, vias tented up to drill 24mil, thermal gap 10mil
Holes 3.2 mm at 96.55,2.55 15.27,50.81 90.2,50.81 14,2.55 66.07,35.57 66.07,7.63
tRestrict: area 42.5,37.2 to 42.9,37.4
bRestrict: 3 lines

### Footprints (pad centres in the part's own frame; a part is rotated, then mirrored left to right if it is on the bottom)
1X08 = drill 0.85 pad 1.422 long: 1 -8.89,0; 2 -6.35,0; 3 -3.81,0; 4 -1.27,0; 5 1.27,0; 6 3.81,0; 7 6.35,0; 8 8.89,0
C0603-ROUND = smd 0.898 x 1.1: 1 -0.889,0; 2 0.889,0
SMB = smd 2.4 x 2.4: A 2.2,0; C -2.2,0
MINIMELF = smd 1.4 x 1.8: A 1.7,0; C -1.7,0
L1812 = smd 1.9 x 3.4: 1 -1.95,0; 2 1.95,0
FIDUCIA-MOUNT = smd 1.016 x 1.016: P$1 0,0
SJ = smd 1.168 x 1.6: 1 -0.762,0; 2 0.762,0
LINEAR_SOT223 = smd 1.219 x 2.235: 1 -2.311,-3.099; 2 0,-3.099; 3 2.311,-3.099 | smd 3.6 x 2.2: 4 0,3.099
TQFP100 = smd 1.5 x 0.3: 1 -8,6; 2 -8,5.5; 3 -8,5; 4 -8,4.5; 5 -8,4; 6 -8,3.5; 7 -8,3; 8 -8,2.5; 9 -8,2; 10 -8,1.5; 11 -8,1; 12 -8,0.5; 13 -8,0; 14 -8,-0.5; 15 -8,-1; 16 -8,-1.5; 17 -8,-2; 18 -8,-2.5; 19 -8,-3; 20 -8,-3.5; 21 -8,-4; 22 -8,-4.5; 23 -8,-5; 24 -8,-5.5; 25 -8,-6; 51 8,-6; 52 8,-5.5; 53 8,-5; 54 8,-4.5; 55 8,-4; 56 8,-3.5; 57 8,-3; 58 8,-2.5; 59 8,-2; 60 8,-1.5; 61 8,-1; 62 8,-0.5; 63 8,0; 64 8,0.5; 65 8,1; 66 8,1.5; 67 8,2; 68 8,2.5; 69 8,3; 70 8,3.5; 71 8,4; 72 8,4.5; 73 8,5; 74 8,5.5; 75 8,6 | smd 0.3 x 1.5: 26 -6,-8; 27 -5.5,-8; 28 -5,-8; 29 -4.5,-8; 30 -4,-8; 31 -3.5,-8; 32 -3,-8; 33 -2.5,-8; 34 -2,-8; 35 -1.5,-8; 36 -1,-8; 37 -0.5,-8; 38 0,-8; 39 0.5,-8; 40 1,-8; 41 1.5,-8; 42 2,-8; 43 2.5,-8; 44 3,-8; 45 3.5,-8; 46 4,-8; 47 4.5,-8; 48 5,-8; 49 5.5,-8; 50 6,-8; 76 6,8; 77 5.5,8; 78 5,8; 79 4.5,8; 80 4,8; 81 3.5,8; 82 3,8; 83 2.5,8; 84 2,8; 85 1.5,8; 86 1,8; 87 0.5,8; 88 0,8; 89 -0.5,8; 90 -1,8; 91 -1.5,8; 92 -2,8; 93 -2.5,8; 94 -3,8; 95 -3.5,8; 96 -4,8; 97 -4.5,8; 98 -5,8; 99 -5.5,8; 100 -6,8
MLF32 = smd 0.7 x 0.28: 1 -2.45,1.75; 2 -2.45,1.25; 3 -2.45,0.75; 4 -2.45,0.25; 5 -2.45,-0.25; 6 -2.45,-0.75; 7 -2.45,-1.25; 8 -2.45,-1.75; 17 2.45,-1.75; 18 2.45,-1.25; 19 2.45,-0.75; 20 2.45,-0.25; 21 2.45,0.25; 22 2.45,0.75; 23 2.45,1.25; 24 2.45,1.75 | smd 0.28 x 0.7: 9 -1.75,-2.45; 10 -1.25,-2.45; 11 -0.75,-2.45; 12 -0.25,-2.45; 13 0.25,-2.45; 14 0.75,-2.45; 15 1.25,-2.45; 16 1.75,-2.45; 25 1.75,2.45; 26 1.25,2.45; 27 0.75,2.45; 28 0.25,2.45; 29 -0.25,2.45; 30 -0.75,2.45; 31 -1.25,2.45; 32 -1.75,2.45 | smd 3.254 x 3.254: 33 0,0
SOT23-DBV = smd 0.55 x 1.2: 1 -0.95,-1.3; 2 0,-1.3; 3 0.95,-1.3; 4 0.95,1.3; 5 -0.95,1.3
MSOP08 = smd 0.3 x 1.2: 1 -0.976,-2.113; 2 -0.326,-2.113; 3 0.324,-2.113; 4 0.974,-2.113; 5 0.974,2.112; 6 0.324,2.112; 7 -0.326,2.112; 8 -0.976,2.112
2X03 = drill 1.016 pad 1.55 octagon: 1 -2.54,-1.27; 2 -2.54,1.27; 3 0,-1.27; 4 0,1.27; 5 2.54,-1.27; 6 2.54,1.27
2X02 = drill 0.95 pad 1.676 octagon: 1 -1.27,-1.27; 2 -1.27,1.27; 3 1.27,-1.27; 4 1.27,1.27
1X10 = drill 0.85 pad 1.422 long: 1 -11.43,0; 2 -8.89,0; 3 -6.35,0; 4 -3.81,0; 5 -1.27,0; 6 1.27,0; 7 3.81,0; 8 6.35,0; 9 8.89,0; 10 11.43,0
CHIPLED_0805 = smd 1.2 x 1.2: A 0,-1.05; C 0,1.05
0805 = smd 1.2 x 1: 1 -1.1,0; 2 1.1,0
HRS_DF50A-10P-1H(51) = smd 0.6 x 1.64: 1 -4.5,4.5; 2 -3.5,4.5; 3 -2.5,4.5; 4 -1.5,4.5; 5 -0.5,4.5; 6 0.5,4.5; 7 1.5,4.5; 8 2.5,4.5; 9 3.5,4.5; 10 4.5,4.5 | smd 1.9 x 2.4: 11 -6.96,-0.79; 12 6.96,-0.79
PANASONIC_D = smd 3 x 1.4: + 2.4,0; - -2.4,0
R0603-ROUND = smd 0.898 x 1.1: 1 -0.889,0; 2 0.889,0
TS42 = smd 1.6 x 1.4: 1 -4.2,2.25; 2 4.2,2.25; 3 -4.2,-2.25; 4 4.2,-2.25; 5 -4.2,0
CAY16 = smd 0.5 x 0.65: 1 -1.2,-0.675; 2 -0.4,-0.675; 3 0.4,-0.675; 4 1.2,-0.675; 5 1.2,0.675; 6 0.4,0.675; 7 -0.4,0.675; 8 -1.2,0.675
SOT-23 = smd 0.787 x 0.889: 1 0.025,-1.016; 2 -0.94,1.016; 3 0.991,1.016
USB-TYPE-C-SMT = smd 0.27 x 0.9: 1 -2.625,0.7; 2 -2.125,0.7; 3 -1.625,0.7; 4 -1.125,0.7; 5 -0.625,0.7; 6 -0.125,0.7; 7 0.375,0.7; 8 0.875,0.7; 9 1.375,0.7; 10 1.875,0.7; 11 2.375,0.7; 12 2.875,0.7 | smd 0.27 x 0.8: B1 2.625,-0.9; B2 2.125,-0.9; B3 1.625,-0.9; B4 1.125,-0.9; B5 0.625,-0.9; B6 0.125,-0.9; B7 -0.375,-0.9; B8 -0.875,-0.9; B9 -1.375,-0.9; B10 -1.875,-0.9; B11 -2.375,-0.9; B12 -2.875,-0.9 | drill 0.6: P$1 -4.32,0.25; P$2 4.32,0.65; P$3 -4.32,0.65; P$4 -4.32,0.45; P$7 -4.32,-0.35; P$8 -4.32,0.05; P$9 -4.32,-0.15; P$10 4.32,0.45; P$11 4.32,0.25; P$12 4.32,0.05; P$13 4.32,-0.15; P$14 4.32,-0.35 | drill 0.7 offset: P$5 5.85,-5.4; P$23 -5.85,-5.4 | drill 0.7: P$6 -5.85,-5.3; P$15 4.27,-0.55; P$16 -4.02,-0.55; P$17 -4.27,-0.55; P$18 4.02,-0.55; P$19 -5.85,-5.7; P$20 -5.85,-5.5; P$21 -5.85,-5.1; P$22 -5.85,-4.9; P$24 5.85,-5.7; P$25 5.85,-5.5; P$26 5.85,-5.3; P$27 5.85,-5.1; P$28 5.85,-4.9
6PINHERMSMD = smd 0.5 x 0.7: P$1 -5,17; P$2 -5,14; P$3 -5,11; P$4 -5,8; P$5 -5,5; P$6 -5,2 | hole 0.65: -4.9,9.5; -0.6,9.5 | hole 0.7: -4.9,9.5; -0.6,9.5
POWERSUPPLY_DC-21MM = drill 1.4 pad 4.826 octagon: 1 -5.08,-3.353; 2 -0.076,-6.35; 3 -0.076,-0.356 | drill 1.4: 4 -5.08,-4.115; 5 -5.08,-2.591; 6 -0.838,-0.356; 7 0.686,-0.356; 8 -0.838,-6.35; 9 0.686,-6.35
2X18 = drill 0.95 pad 1.676 octagon: 1 -21.59,-1.27; 2 -21.59,1.27; 3 -19.05,-1.27; 4 -19.05,1.27; 5 -16.51,-1.27; 6 -16.51,1.27; 7 -13.97,-1.27; 8 -13.97,1.27; 9 -11.43,-1.27; 10 -11.43,1.27; 11 -8.89,-1.27; 12 -8.89,1.27; 13 -6.35,-1.27; 14 -6.35,1.27; 15 -3.81,-1.27; 16 -3.81,1.27; 17 -1.27,-1.27; 18 -1.27,1.27; 19 1.27,-1.27; 20 1.27,1.27; 21 3.81,-1.27; 22 3.81,1.27; 23 6.35,-1.27; 24 6.35,1.27; 25 8.89,-1.27; 26 8.89,1.27; 27 11.43,-1.27; 28 11.43,1.27; 29 13.97,-1.27; 30 13.97,1.27; 31 16.51,-1.27; 32 16.51,1.27; 33 19.05,-1.27; 34 19.05,1.27; 35 21.59,-1.27; 36 21.59,1.27
RESONATOR = smd 0.7 x 2: 1 -1,0; 2 0,0; 3 1,0
QS = drill 0.85 pad 1.676 octagon: 1 -2.54,0; 2 2.54,0
CT/CN0603 = smd 1 x 1: 1 -1,0; 2 1,0

### Placement (x,y rotation side)
ADCH  116.68,4.45 0 top  (outside the outline)
ADCL  113.12,31.35 0 top
C1  33.55,14.62 270 top
C2  14.38,17.67 270 top
C3  27.97,44.46 0 top
C4  38.63,7.12 0 top
C5  57,113.64 180 top
C6  40.07,30.43 180 top
C7  27.97,18.3 0 top
C8  12.09,31 180 top
C9  12.09,29.35 180 top
C10  15.34,37.22 180 top
C11  24.79,29.35 0 top
C12  21.62,17.16 180 top
C13  27.97,21.6 0 top
C14  15.27,29.35 180 top
C15  21.62,29.35 0 top
C16  43.66,36.88 270 top
COMMUNICATION  114.9,47.71 180 top  (outside the outline)
D1  21.62,2.81 180 top
D2  13.11,46.24 90 top
D3  35.59,14.62 90 top
F1  4.47,26.68 90 top
FD1  70.87,38.2 0 top
FD2  2.69,2.43 0 top
FD4  53.52,101.96 0 top
GROUND  10.82,33.03 180 bottom
IC1  8.66,17.79 90 top
IC3  53.52,101.96 0 top
IC4  19.96,34.81 90 top
IC6  27.97,25.18 180 top
IC7  18.44,21.35 90 top
ICSP  31.92,82.95 270 top
ICSP1  18.31,46.24 180 top
JP5  19.58,41.16 90 top
JP6  111.25,73.31 0 top
L  27.97,42.18 90 top
L1  11.99,41.52 180 top
L2  41.71,37.74 270 top
ON  31.83,78.18 270 top
P1  -19.97,85.01 0 top  (outside the outline)
PC1  18.44,9.16 90 top
PC2  25.55,9.16 90 top
POWER  115.36,16.55 0 top  (outside the outline)
PWML  111.24,56.51 180 top
R1  40.54,14.62 90 top
R2  18.44,29.35 0 top
RESET  6.25,48.78 0 top
RESET-EN  27.97,15.76 0 top
RN1  81.67,39.84 270 top
RN2  12.09,37.1 90 top
RN3  27.97,39.38 270 top
RN4  27.97,31.13 90 top
RN5  18.44,16.52 90 top
RX  27.97,34.3 90 top
T1  9.17,25.92 270 top
TX  27.97,36.59 90 top
U$1  71.02,83.85 0 top
U$2  44.03,77.01 270 top
U$3  63.03,127.01 90 top
U$4  79.03,92.01 0 top
U$5  29.03,112.01 180 top
X1  5.36,8.39 90 top
XIO  136.08,48.32 270 top  (outside the outline)
Y1  38.38,14.62 270 top
Y2  18.44,26.05 180 top
Z1  12.09,34.3 0 top
Z2  12.09,39.69 0 top

### Tracks (layer width: path | path; a pad name or v marks a point on that pad's centre or on a via)
5-GND  (via drill 0.41)
  Top 0.203: RESET.5 v0.61,48.78
8PB1
  Top 0.254: 19.68,37.3 19.68,37.9 19.05,38.53 17.78,38.53 17.01,39.3 17.01,39.42
  Top 0.305: 17.01,39.42 17.01,41.2 18.28,42.47
8PB2
  Top 0.254: 20.18,37.3 20.18,38.16 18.41,39.93 18.28,39.93
8PB3
  Top 0.254: 19.55,41.2 19.55,39.47 20.68,38.34 20.68,37.3
  Top 0.305: 19.55,41.2 20.82,42.47
8PB4  (1 unrouted)
8PB5  (1 unrouted)
8PB6  (1 unrouted)
8PB7  (1 unrouted)
8PB8
  Top 0.254: 20.57,39.93 20.82,39.93 21.18,39.57 21.18,37.3
+3V1
  Top 0.305: 16.3,21.71 15.42,21.71 15.11,22.02 15.11,22.91 15.74,23.55 23.11,23.55 24.63,22.02
  Top 0.406: 28.89,21.67 28.89,23.92
  Top 0.61: 28.89,21.67 28.82,21.64 28.95,21.6 28.95,21.01 28.44,20.5 25.14,20.5 24.63,21.01 24.63,22.02
+3V3  (3 unrouted)
+5V  (33 unrouted)
  pour Top (isolate 0.406, no thermals): 9.55,13.35 9.55,29.86 0.66,29.86 0.66,13.35
  pour Bottom: 1.5,13.35 1.5,29.86 10.82,29.86 10.82,13.35
+5V1  (8 unrouted)
  Top 0.254: 28.06,28.12 28,28.25 27.94,28.69 27.94,31.42 27.79,31.57 26.78,31.57 26.7,31.65 26.7,32.25 26.81,32.37 27.26,32.37 | 17.74,15.36 18.23,15.36 18.41,15.55 18.41,16.05 18.52,16.16 19.09,16.16 | 17.48,33.1 16.41,33.1 16,32.69
  Top 0.279: 19.68,32.4 19.68,31.67 20.06,31.29
  Top 0.305: 24.63,40.18 26.41,40.18 26.73,40.57 27.26,40.62 | 12.95,29.39 13.97,30.41 15.24,30.41 | 19.09,16.16 23.6,16.16 23.87,16.44 | 22.6,31.29 20.06,31.29 | 13.08,44.58 14.14,44.58 14.98,43.74 19.55,43.74 20.82,45.01 | 35.56,12.96 35,12.96 34.79,12.75 32.63,12.75 31.67,12.75 31.92,12.96 31.62,13.26
  Top 0.406: 25.65,29.39 25.52,29.14 26.99,27.68 | 25.65,29.39 25.65,29.64 24.13,31.17 22.73,31.17 22.6,31.29 | 25.65,29.39 24.51,28.25 23.96,28.25 22.86,27.02 22.86,24.31 22.6,24.18 15.36,24.18 14.47,23.29 14.47,21.39 15.46,20.4 16.31,20.4 16.3,20.41 | 16,32.69 16,31.17 15.24,30.41
  Top 0.508: 26.96,26.72 26.99,26.52 26.99,27.68 27.3,27.99 27.94,27.99 | 28.89,26.52 28.89,27.3 28.06,28.12
  Top 0.61: 28.06,28.12 27.94,27.99
  Top 0.813: 9.27,17.83 11.73,17.83 | 10.16,26.9 10.1,26.9 8.89,27.99
  Top 1.27: 31.62,14.66 31.62,13.26 31.62,12.63 28.13,9.13 27.05,9.7 26.54,9.96 25.52,10.97 25.52,11.6
  Bottom 0.406: 23.49,41.2 16.76,41.2 16.63,41.33 16.25,41.33 | 17.27,43.74 20.19,43.74 | 23.87,16.44 30.09,16.44
  Bottom 0.61: 23.62,41.33 23.49,41.2 | 16.25,41.33 16.89,41.84 16.89,43.36 17.27,43.74 | 20.19,43.74 20.82,44.38 20.82,45.01 | 15.24,30.41 16.12,31.29 22.6,31.29 22.6,32.95 17.78,37.77 17.27,37.77 16.38,38.66 15.87,38.66 15.11,39.42 15.11,41.33
  Bottom 1.27: 20.82,45.01 20.95,44.88 21.59,44.5 22.86,43.23 22.86,42.09 23.62,41.33 23.62,41.2 27.17,37.64 27.17,29.01 28.95,27.23 29.97,26.34 29.97,22.79 30.09,22.79 | 30.09,22.79 30.09,16.44 30.09,16.05 31.62,14.66 | 30.09,22.79 32.76,22.79 | 8.89,29.26 8.25,29.9 8.25,31.8 4.44,35.61 4.44,40.44 5.33,41.33 15.11,41.33 16.25,41.33
ADC0  (1 unrouted)
ADC1  (1 unrouted)
ADC2  (1 unrouted)
ADC3  (1 unrouted)
ADC4  (1 unrouted)
ADC5  (1 unrouted)
ADC6  (1 unrouted)
ADC7  (1 unrouted)
ADC8  (1 unrouted)
ADC9  (1 unrouted)
ADC10  (1 unrouted)
ADC11  (1 unrouted)
ADC12  (1 unrouted)
ADC13  (1 unrouted)
ADC14  (1 unrouted)
ADC15  (1 unrouted)
AREF  (2 unrouted)
AREF1  (1 unrouted)
  Top 0.203: 27.05,44.5 25.52,44.5 24.76,45.26 24.76,49.2 23.87,50.09 23.87,50.85
  Top 0.305: 28.19,45.9 27.72,45.65 27.05,44.5
  Bottom 0.305: 28.19,45.9 42.18,45.9
AVCC  (2 unrouted)
CMP  (3 unrouted)
CMP1
  Top 0.203: 20.7,17.2 20.7,17.45 18.03,20.12 18.03,21.9 17.56,22.36 16.3,22.36
  Top 0.254: 19.07,16.94 18.54,16.94 18.41,17.07 18.41,17.58 18.23,17.76 17.74,17.76
  Top 0.305: 19.07,16.94 19.09,16.96 19.87,16.96 20.46,16.96 20.7,17.2
D+  (3 unrouted)
D+1
  Top 0.406: 6.98,40.69 7.2,40.91 9.05,40.91 10.03,39.93 10.03,38.79 10.41,38.41 11.32,38.41 11.39,38.34 11.61,38.34 12.01,38.74 12.01,38.97 12.44,39.4 12.73,39.4 13.06,39.73 12.93,39.55
  Top 0.61: 6.52,39.4 6.52,40.23 6.98,40.69
D-  (3 unrouted)
D-1
  Top 0.406: 9.52,38.15 9.56,38.15 10.03,37.68 10.03,37.64 10.79,35.87 11.32,35.87 11.39,35.94 12.73,34.6 13.06,34.34
  Top 0.61: 8.52,39.4 8.52,39.15 9.52,38.15
DTR  (2 unrouted)
DTR1  (2 unrouted)
  Top 0.254: 24.25,38.22 23.8,38.22 23.74,38.28 | 24.25,38.22 27.26,38.22 | 22.38,35.1 24.25,35.1 25.01,35.87 25.01,37.46 24.25,38.22
  Top 0.305: 27.05,18.34 26.03,18.34 25.78,18.21
  Bottom 0.254: 25.78,18.21 25.9,18.21 27.17,19.48 27.17,25.45 25.01,27.61 25.01,37.01 23.74,38.28
GATE_CMD  (1 unrouted)
GATE_CMD1
  Top 0.305: 10.16,24.97 10.28,24.84 10.28,21.77 10.79,21.26 12.95,21.26 13.2,21.01 13.84,21.01 15.49,19.36 17.01,19.36 17.52,19.86 17.52,20.75 17.21,21.06 16.3,21.06
  Top 0.406: 10.16,24.97 10.16,24.69
GND  (via drill 0.41)  (42 unrouted)
  Top 0.305: RESET.1 v0.61,51.03 | RESET.2 v11.88,51.03
  pour Top (isolate 0.305, rank 2): 0.36,52.72 0.66,0.65 0.66,29.86 10.82,29.86 10.77,45.91 0.3,45.91
  pour Bottom (isolate 0.305, rank 2): 0.66,52.72 1.3,0.65 0.66,1.28 0.66,29.86 10.82,29.86 10.77,46.27 0.61,46.27
GND1  (5 unrouted)
  Top 0.279: 19.18,31.28 19.18,32.4 | 19.18,33.38 19.18,33.41 19.19,33.42 19.19,32.35
  Top 0.305: 11.73,15.52 11.81,15.55 | 18.82,33.73 19.23,33.73 | 22.47,29.39 22.47,29.52 21.46,30.53 19.93,30.53 19.18,31.28 | 19.93,34.85 19.93,33.38 18.82,33.73 | 18.82,33.73 19.18,33.37 | 19.18,33.38 18.82,33.73 | 19.09,17.76 19.09,18.05 18.54,18.59 18.16,18.59 17.9,18.85
  Bottom 0.279: 19.18,32.38 19.2,32.38 18.94,32.41 18.94,33.43
  Bottom 0.305: 11.55,33.07 10.16,33.07
L1
  Top 0.203: 28.61,39.82 31,39.82 31.49,40.31 32.89,40.31 33.27,39.93 33.27,23.04 34.67,21.64 34.67,20.25 34.29,19.86 22.86,19.86 21.97,20.75 | 20.52,21.06 21.78,21.06 21.97,20.88 21.97,20.75 | 20.52,20.41 21.8,20.41 21.97,20.63 21.97,20.75
L13  (2 unrouted)
M8RXD  (1 unrouted)
M8RXD1
  Top 0.254: 27.24,30.79 27.26,30.77 | 22.38,33.1 25.24,33.1 25.4,32.95
  Top 0.305: 27.24,30.79 26.67,30.79 26.08,31.24 26.08,32.13 25.4,32.95
M8TXD  (1 unrouted)
M8TXD1
  Top 0.254: 24.83,32.5 24.19,32.5 24.09,32.4 21.68,32.4
  Top 0.305: 24.83,32.5 25.42,31.9 25.42,31.01 26.41,30.02 27.2,30.02 27.26,29.97
MISO1
  Top 0.254: 21.68,37.3 21.68,39.01 22.22,39.55 22.22,45.39 20.82,46.79 20.82,47.55
MISO2  (1 unrouted)
MOSI1  (1 unrouted)
  Top 0.254: 22.47,46.41 22.86,46.03 22.86,39.42 22.35,38.91 22.35,36.76 22.38,36.67 22.38,36.6
  Bottom 0.254: 18.28,45.01 18.79,45.01 20.06,46.28 22.22,46.28 22.35,46.41 22.47,46.41
MOSI2  (1 unrouted)
N$1  (3 unrouted)
N$2  (1 unrouted)
N$3  (1 unrouted)
N$4  (3 unrouted)
N$5  (3 unrouted)
N$6  (3 unrouted)
N$7  (3 unrouted)
N$8  (3 unrouted)
N$9  (1 unrouted)
  Top 0.254: 30.48,46.79 30.98,46.28 30.98,42.22 29.33,40.57 28.88,40.57 28.61,40.62
  Bottom 0.203: 30.48,46.79 43.05,46.79
N$10
  Top 0.254: 28.61,32.37 28.61,33.87 28.99,34.34
N$11
  Top 0.254: 28.61,31.57 29.48,31.57 30.22,32.31 30.22,35.23 28.99,36.47 28.99,36.63
N$12
  Top 0.254: 27.26,39.82 27.75,39.87 27.94,40.06 27.94,41.71 28.19,41.96 28.99,42.22
N$13  (via drill 0.41)
  other vias: 1.03,43.01
N$14  (via drill 0.41)
  other vias: 4.03,44.01
N$15  (via drill 0.41)
  other vias: 9.53,43.01
N$16  (via drill 0.41)
  other vias: 4.03,33.01
N$17  (via drill 0.41)
  other vias: 6.53,36.51
N$54  (1 unrouted)
N$55  (1 unrouted)
PA0  (1 unrouted)
PA1  (1 unrouted)
PA2  (1 unrouted)
PA3  (1 unrouted)
PA4  (1 unrouted)
PA5  (1 unrouted)
PA6  (1 unrouted)
PA7  (1 unrouted)
PB0  (1 unrouted)
PB1  (2 unrouted)
PB2  (2 unrouted)
PB3  (2 unrouted)
PB4  (1 unrouted)
PB5  (1 unrouted)
PB6  (1 unrouted)
PB7  (2 unrouted)
PB8
  Top 0.203: 34.74,24.18 34.74,48.57 34.03,49.33 34.03,50.85
PB9
  Top 0.203: 35.2,24.44 35.2,47.68 36.57,48.95 36.57,50.85
PB10
  Top 0.203: 34.29,23.93 34.29,47.68 31.75,50.22 31.49,50.85
PB11  (1 unrouted)
  Top 0.203: 30.86,40.82 33.14,40.82 33.78,40.18 33.78,23.29 35.15,21.92 35.15,20.09 34.41,19.36 20.32,19.36 19.43,20.25 19.43,21.26 19.81,21.64 20.45,21.64 20.52,21.71
  Bottom 0.254: 28.95,50.85 29.21,49.58 26.67,47.04 26.67,45.14 28.57,43.23 28.57,43.11 30.86,40.82
PC0  (1 unrouted)
PC1  (1 unrouted)
PC2  (1 unrouted)
PC3  (1 unrouted)
PC4  (1 unrouted)
PC5  (1 unrouted)
PC6  (1 unrouted)
PC7  (1 unrouted)
PD7  (1 unrouted)
PE0  (2 unrouted)
PE1  (2 unrouted)
PE2  (1 unrouted)
  Top 0.254: 28.61,29.97 29.91,29.97 31.49,31.55 31.49,36.37
  Bottom 0.305: 31.49,36.37 34.54,36.37 36.62,38.46 39.14,38.46
PE3  (1 unrouted)
PE4  (1 unrouted)
PE5  (1 unrouted)
PE6  (1 unrouted)
  Top 0.254: 30.6,37.52 30.53,37.45 30.53,35.8 30.86,35.49 30.86,31.93 29.71,30.79 28.63,30.79 28.61,30.77
  Bottom 0.305: 30.6,37.52 33.96,37.52 36.22,39.78 39.7,39.78
PG0  (1 unrouted)
PG1  (1 unrouted)
PG2  (1 unrouted)
PG5  (1 unrouted)
PH1
  Top 0.203: 39.87,48.95 36.57,45.9 36.57,27.48
PH2
  Top 0.203: 36.11,27.18 36.11,46.15 39.62,49.46
PH3  (1 unrouted)
PH4  (1 unrouted)
PH5  (1 unrouted)
PH6  (1 unrouted)
PH7
  Top 0.203: 35.66,26.87 35.66,46.86 39.11,50.22
PL0  (1 unrouted)
PL1  (1 unrouted)
PL2  (1 unrouted)
PL3  (1 unrouted)
PL4  (1 unrouted)
PL5  (1 unrouted)
PL6  (1 unrouted)
PL7  (1 unrouted)
PWRIN  (1 unrouted)
PWRIN1
  Top 1.016: 19.39,2.85 18.28,2.85 17.01,4.12 17.01,4.24 15.36,5.89 15.24,5.89 13.46,7.67 12.37,7.67 11.68,8.36
RD+  (1 unrouted)
RD+1
  Top 0.254: 17.48,34.6 15.64,34.6 13.51,36.73 13.51,38.05 13.25,38.3 12.77,38.3 12.74,38.34
RD-  (1 unrouted)
RD-1
  Top 0.254: 12.74,35.94 13.27,35.91 13.5,35.91 13.97,35.44 13.97,35.1 14.97,34.1 17.48,34.1
RESET  (10 unrouted)
RESET1  (2 unrouted)
  Top 0.254: 28.79,17.92 28.15,17.92 27.3,17.07 27.3,15.93 27.17,15.8
  Top 0.305: 28.79,17.92 28.82,18.34 | 27.17,15.8 28.7,15.8 | 27.17,15.8 27.3,15.42 | 35.56,18.85 35.56,16.36 34.33,16.36 33.52,15.55 | 35.56,18.85 35.56,19.1 | 28.7,15.8 28.7,16.69 30.86,18.85 35.56,18.85 | 27.17,15.8 26.74,15.36 19.09,15.36 19.1,15.35 | 28.7,15.8 28.7,12.88 28.06,12.24 | 10.42,46.57 10.4,46.59 2.03,46.59 1.21,45.77 1.21,43.18
  Top 0.406: 10.42,46.57 10.46,46.57
  Bottom 0.305: 1.21,43.18 0.66,42.62 0.66,12.8 1.32,12.14 27.96,12.14 28.06,12.24
RESET2  (3 unrouted)
RESET3  (2 unrouted)
  Top 0.254: 18.18,37.3 16.51,38.98 16.51,39.17 | 17.74,16.16 17.38,16.16 16.51,15.29
  Top 0.305: 15.74,47.55 14.98,47.55 | 16.51,15.29 16.58,15.36 | 16.25,39.8 16.25,41.45 14.35,43.36 12.19,43.36 11.76,43.79 11.76,46.66 13.08,47.98 | 16.19,39.87 16.25,39.8 | 16.51,39.17 16.51,39.55 16.25,39.8
  Top 0.61: 13.08,47.98 13.63,47.55 15.74,47.55
  Bottom 0.305: 16.51,15.29 16.76,15.29 16.76,21.26 19.43,23.8 19.43,29.14 20.57,30.28 23.24,30.28 23.49,30.53 23.49,33.18 18.14,38.53 17.65,38.53 16.44,39.74 16.19,39.87
RXD1  (1 unrouted)
RXD2  (1 unrouted)
RXD3  (1 unrouted)
RXL  (1 unrouted)
RXL1
  Top 0.254: 26.27,33.73 25.76,33.73 25.63,33.6 22.38,33.6
  Top 0.305: 26.27,33.73 26.89,34.34
SCK1
  Top 0.254: 18.28,47.55 19.43,48.69 22.22,48.69 23.49,47.42 23.49,39.3 22.86,38.66 22.86,37.9 23.49,37.26 23.49,36.5 23.09,36.1 22.38,36.1
SCK2  (1 unrouted)
SCL  (3 unrouted)
SCL1
  Bottom 0.203: 18.79,50.85 18.79,50.34 19.81,49.33 22.22,49.33 25.65,45.9 25.65,43.99 30.22,39.42 31.49,39.42 32.63,40.57 32.63,42.5 34.64,44.5 40.31,44.5
SDA  (3 unrouted)
SDA1
  Bottom 0.203: 21.33,50.85 21.46,50.85 26.16,46.15 26.16,44.25 30.48,39.93 31.24,39.93 32.13,40.82 32.13,42.72 34.49,45.09 40.91,45.09
TXD1  (1 unrouted)
TXD2  (1 unrouted)
TXD3  (1 unrouted)
TXL  (1 unrouted)
TXL1
  Top 0.254: 26.89,36.63 26.79,36.88 24.01,34.1 22.38,34.1
UGND  (7 unrouted)
UGND1  (1 unrouted)
  Top 0.254: 17.48,35.1 16.2,35.1 15.64,35.66
  Top 0.406: 15.64,35.66 14.58,36.73 14.58,37.11 14.42,37.26
  Top 0.813: 6.52,36.9 6.5,36.88 5.08,36.88 4.44,37.52 4.44,40.57 7.56,43.69 7.62,43.69 8.58,44.65 10.26,44.65 10.82,44.1 10.82,44.05 10.92,43.94 10.92,43.44 12.04,42.37 12.25,42.37 13.06,41.56 13.91,41.56 14.52,40.95 14.52,37.37 14.42,37.26
  Bottom 0.813: 6.52,36.9 6.52,36.59 10.03,33.07
USBVCC  (3 unrouted)
USBVCC1
  Top 0.254: 17.48,33.6 15.89,33.6 15.11,32.82 15.11,32.06 14.35,31.29
  Top 0.305: 14.35,31.29 13.2,31.29 12.95,31.04
  Top 0.406: 12.95,31.04 12.95,31.55 12.31,32.18 10.79,32.18 10.16,31.55 10.16,28.63 11.55,27.23 11.55,25.94
  Top 0.61: 11.55,25.94 8.12,25.94 6.96,24.77 4.44,24.77
USHIELD  (30 unrouted)
USHIELD1  (3 unrouted)
  Top 0.406: 10.86,41.56 10.86,41.4
  Top 0.813: 3.81,32.15 3.81,33.07 5.08,33.07 5.71,33.71 9.79,33.71 11.06,34.34 | 9.65,43.23 9.65,41.96 10.05,41.56 10.86,41.56 11.06,41.35 11.06,39.73 | 3.81,44.15 4.61,44.96
  Bottom 0.813: 9.65,43.23 4.98,43.23 3.81,44.15
  Bottom 1.27: 3.81,32.15 3.81,33.07 2.1,34.77 2.1,41.48 3.81,43.23 3.81,44.15
VBUS  (4 unrouted)
VIN  (5 unrouted)
VIN1
  Top 0.203: 11.76,20.11 11.73,20.14
  Top 0.305: 17.74,16.96 15.98,16.96 15.74,17.2
  Top 0.813: 24,7.42 22.59,7.42 18.41,11.6 17.03,11.6 15.24,13.39 15.24,15.8 15.74,16.31 15.74,17.2 12.83,20.11 11.76,20.11
  Top 1.016: 23.79,2.85 24,3.06 24,7.42
VUCAP  (1 unrouted)
VUCAP1
  Top 0.254: 17.48,35.6 16.82,35.6 16.56,35.87
  Top 0.406: 16.56,35.87 16.25,36.17 16.25,37.21 16.2,37.26
XT1  (3 unrouted)
XT2  (3 unrouted)
XT3
  Top 0.254: 18.68,32.4 18.68,30 19.3,29.39 | 20.7,29.39 20.7,26.34 20.95,26.09
  Top 0.406: 20.7,29.39 19.3,29.39
XT4
  Top 0.203: 17.98,29.85 17.98,29.75 17.63,29.39
  Top 0.254: 17.8,29.39 17.63,29.39 17.52,29.39 17.98,29.85 18.18,30.05 18.18,31.61 | 18.18,31.61 18.18,32.4 | 18.18,31.61
  Top 0.305: 16.12,29.39 16.12,26.34 15.87,26.09
  Top 0.406: 16.12,29.39 17.52,29.39
XTAL1  (2 unrouted)
XTAL2  (2 unrouted)
XVCC
  Top 0.61: 4.44,28.67 2.49,28.67 1.52,29.64 1.52,34.09 2.41,34.98 7.44,34.98 8.53,36.07 8.53,36.89 8.52,36.9

### Text on the board
Bottom: Mega2560 Rev3E
tPlace: 9 | 8 | 7 | 6 | 5 | 4 | 3 | 2 | 1 | 0 | 22 | 14 | 15 | 16 | 17 | 18 | 19 | 20 | 21 | 13 | 12 | 11 | 10 | 24 | 26 | 28 | 30 | 31 | 32 | 33 | 34 | 35 | 36 | 37 | 38 | 39 | 40 | 41 | 42 | 43 | 44 | 45 | 46 | 47 | TM | 48 | 49 | 50 | 51 | 52 | 53 | 0 | 1 | 2 | 3 | 4 | 5 | 6 | 7 | 8 | 9 | 10 | 11 | 12 | 13 | 14 | 15
tNames: SCL | SDA | 5V | GND | AREF | PWM | TX | RX | TX3 | RX3 | TX2 | RX2 | TX1 | RX1 | SDA | SCL | MADE IN | 1 | ITALY | DIGITAL | Arduino | MEGA 2560 | PC1 | PC2 | ANALOG IN | GND | IOREF | RESET | 3V3 | 5V | GND | VIN
bNames: MADE IN | ITALY | designed by | tinker it
ReferenceLC: L | ON | TX | RX
test-probe: SCL | SDA | AREF | GND3 | 13 | 12 | 11 | 10 | 9 | 8 | 7 | 6 | 5 | 4 | 3 | 2 | 1 | 0 | 14 | 15 | 16 | 17 | 18 | 19 | 20 | 21 | 5V_2 | 5V_3 | 22 | 23 | 24 | 25 | ISP2_6 | ISP2_4 | ISP2_2 | ISP2_1 | ISP2_3 | ISP2_5 | 26 | 27 | USB1_D+ | USB1_D- | 28 | 29 | 30 | 31 | USB1_GND | USB1_5V+ | 32 | 33 | 34 | 35 | ISP1_1 | ISP1_2 | 36 | 37 | ISP1_3 | ISP1_4 | 38 | 39 | ISP1_5 | ISP1_6 | 40 | 41 | 42 | 43 | 44 | 45 | 46 | 47 | 48 | 49 | 50 | 51 | DC_Vin- | DC_Vin+ | 52 | 53 | GND4 | GND5 | IOREF | RESET | 3V3 | 5V_1 | GND1 | GND2 | VIN | A0 | A1 | A2 | A3 | A4 | A5 | A6 | A7 | A8 | A9 | A10 | A11 | A12 | A13 | A14 | A15